# EAGLE design climate_control (EAGLE 6.5.0)
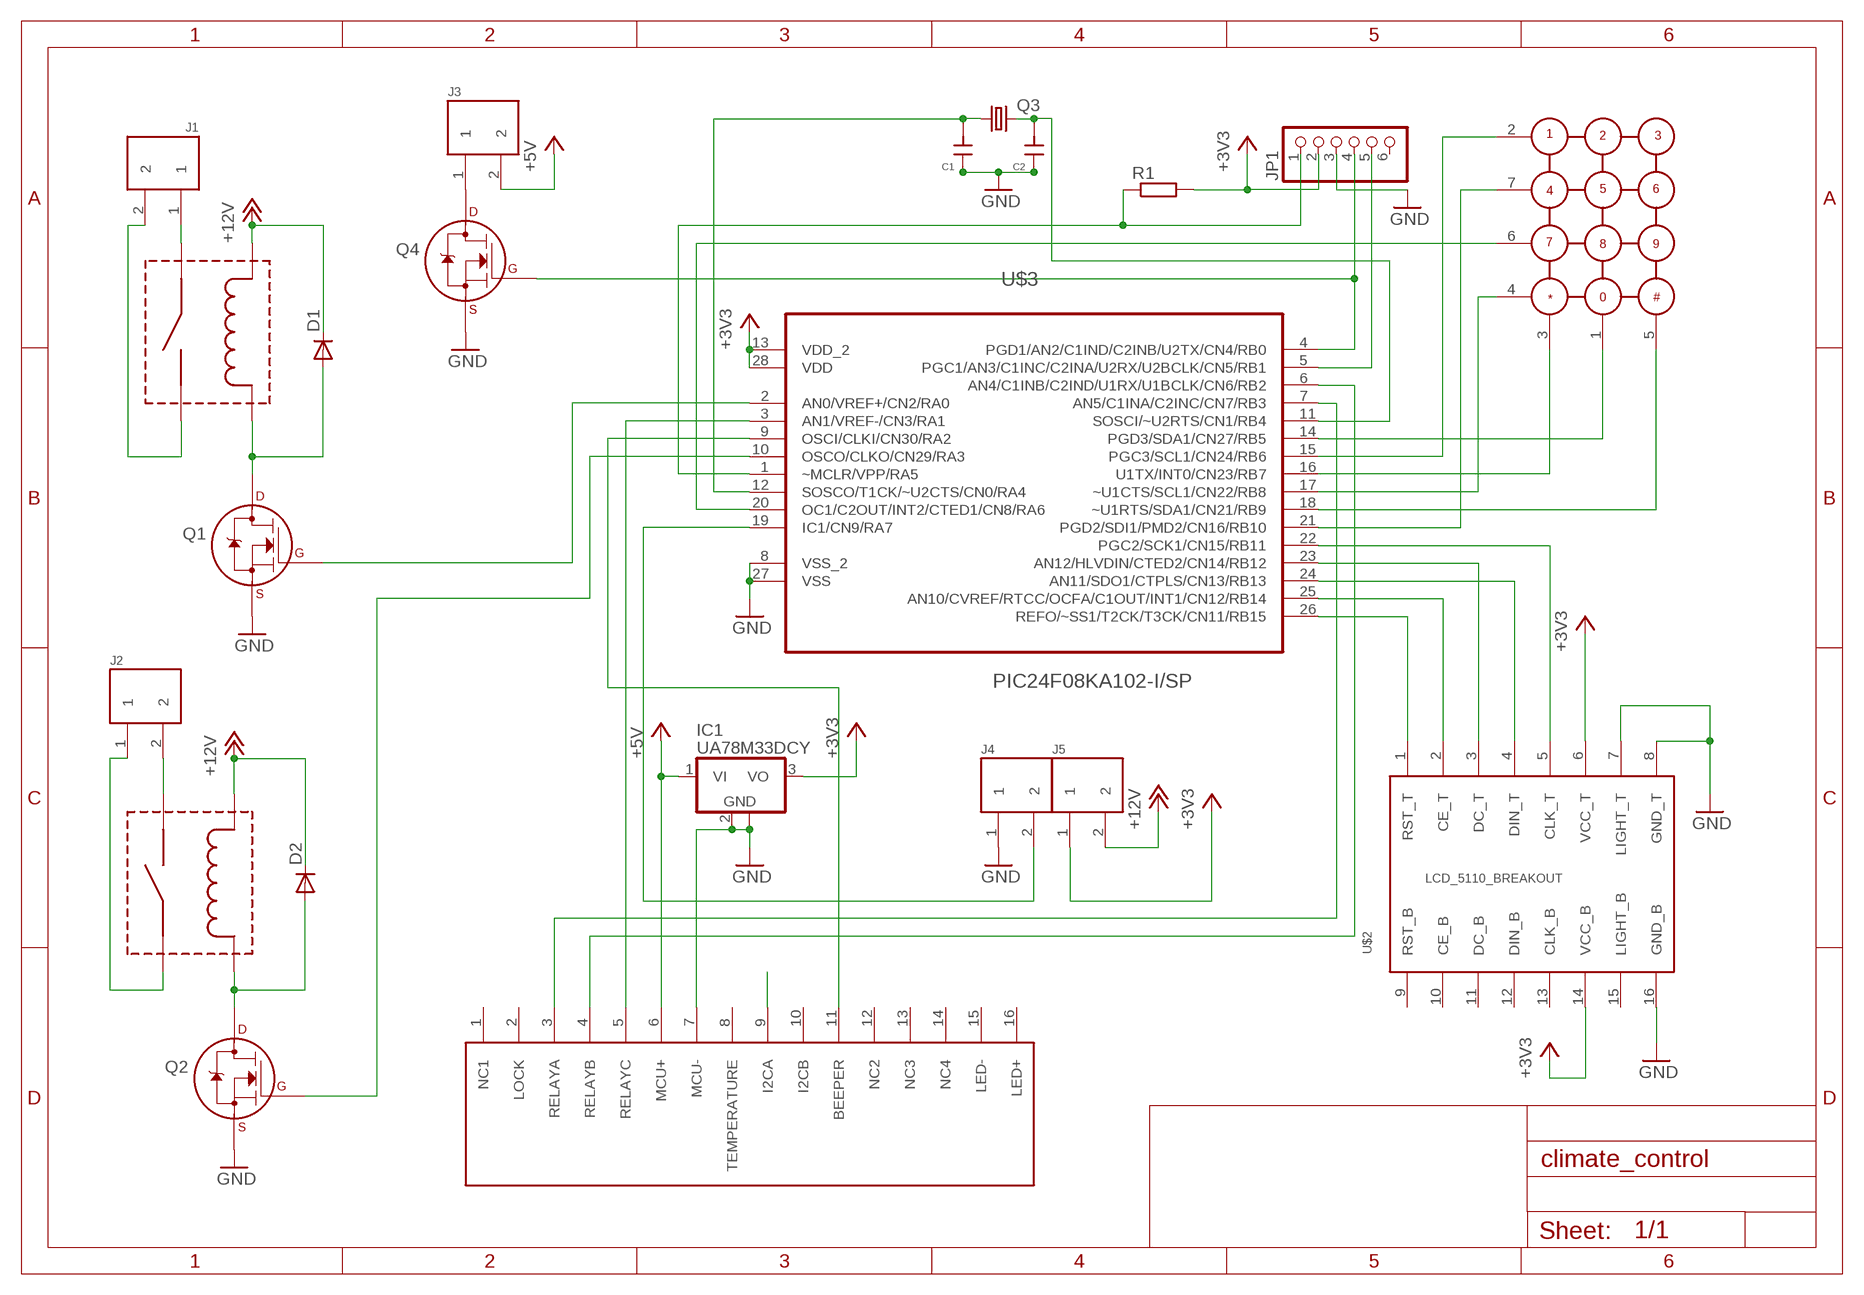
[diagram p0: schematic, sheet 1]

## Parts
C1  DUALCAP  [DUALCAP]
C2  DUALCAP  [DUALCAP]
D1  DIODE-DO-214AC  [DO-214AC]
D2  DIODE-DO-214AC  [DO-214AC]
IC1  UA78M33DCY  [SOT223]
J1  TERMINAL_PCB_508_X2  [TERMINAL_PCB_508_PITCH]
J2  TERMINAL_PCB_508_X2  [TERMINAL_PCB_508_PITCH]
J3  TERMINAL_PCB_508_X2  [TERMINAL_PCB_508_PITCH]
J4  TERMINAL_PCB_508_X2  [TERMINAL_PCB_508_PITCH]
J5  TERMINAL_PCB_508_X2  [TERMINAL_PCB_508_PITCH]
JP1  PINHD-1X6  [1X06]
Q1  2N7000_TO92  [TO-92]
Q2  2N7000_TO92  [TO-92]
Q3  CRYSTALTC38H  [TC38H]
Q4  2N7000_TO92  [TO-92]
R1  R-EU_0207/10  [0207/10]
U$1  KEYPAD12  [KEYPAD12]
U$2  LCD_5110_BREAKOUT  [LCD_5110_BREAKOUT]
U$3  PIC24F08KA102-I/SP  [DIP254P762X533-28]
U$4  WILLHI_EDGE  [WILLHI_EDGE]
U$5  RELAY_JZC-33F  [RELAY_JZC-33F]
U$7  RELAY_JZC-33F  [RELAY_JZC-33F]

## Nets
+3V3: IC1.3(VO) J5.1 JP1.2 R1.2 U$2.6(VCC_T) U$2.14(VCC_B) U$3.13(VDD_2) U$3.28(VDD)
+5V: IC1.1(VI) J3.2 U$4.6(MCU+)
+12V: D1.C D2.C J5.2 U$5.COIL1 U$7.COIL2
GND: C1.P$2 C1.P$3 C2.P$2 C2.P$3 IC1.2(GND) IC1.4(GND) J4.1 JP1.3 Q1.1(S) Q2.1(S) Q4.1(S) U$2.7(LIGHT_T) U$2.8(GND_T) U$2.16(GND_B) U$3.8(VSS_2) U$3.27(VSS) U$4.7(MCU-)
N$1: U$2.4(DIN_T) U$3.24(AN11/SDO1/CTPLS/CN13/RB13)
N$2: U$2.5(CLK_T) U$3.22(PGC2/SCK1/CN15/RB11)
N$3: U$2.3(DC_T) U$3.23(AN12/HLVDIN/CTED2/CN14/RB12)
N$4: U$2.2(CE_T) U$3.25(AN10/CVREF/RTCC/OCFA/C1OUT/INT1/CN12/RB14)
N$5: U$2.1(RST_T) U$3.26(REFO/~SS1/T2CK/T3CK/CN11/RB15)
N$6: U$1.7 U$3.21(PGD2/SDI1/PMD2/CN16/RB10)
N$7: U$1.6 U$3.20(OC1/C2OUT/INT2/CTED1/CN8/RA6)
N$8: U$1.4(*0#) U$3.17(~U1CTS/SCL1/CN22/RB8)
N$9: U$1.5(369#) U$3.18(~U1RTS/SDA1/CN21/RB9)
N$10: U$1.3(147*) U$3.16(U1TX/INT0/CN23/RB7)
N$11: U$1.2 U$3.15(PGC3/SCL1/CN24/RB6)
N$12: U$1.1 U$3.14(PGD3/SDA1/CN27/RB5)
N$13: U$3.9(OSCI/CLKI/CN30/RA2) U$4.11(BEEPER)
N$14: U$4.9(I2CA)
N$15: JP1.1 R1.1 U$3.1(~MCLR/VPP/RA5)
N$16: U$3.3(AN1/VREF-/CN3/RA1) U$4.5(RELAYC)
N$17: JP1.4 Q4.2(G) U$3.4(PGD1/AN2/C1IND/C2INB/U2TX/CN4/RB0)
N$18: JP1.5 U$3.5(PGC1/AN3/C1INC/C2INA/U2RX/U2BCLK/CN5/RB1)
N$19: J4.2 U$3.19(IC1/CN9/RA7)
N$20: U$3.6(AN4/C1INB/C2IND/U1RX/U1BCLK/CN6/RB2) U$4.4(RELAYB)
N$21: U$3.7(AN5/C1INA/C2INC/CN7/RB3) U$4.3(RELAYA)
N$22: D1.A Q1.3(D) U$5.COIL2
N$23: J1.1 U$5.CONTACT1
N$25: J1.2 U$5.CONTACT2
N$26: D2.A Q2.3(D) U$7.COIL1
N$27: J2.2 U$7.CONTACT2
N$28: J2.1 U$7.CONTACT1
N$29: Q1.2(G) U$3.2(AN0/VREF+/CN2/RA0)
N$30: Q2.2(G) U$3.10(OSCO/CLKO/CN29/RA3)
N$31: C1.P$1 Q3.1 U$3.12(SOSCO/T1CK/~U2CTS/CN0/RA4)
N$32: C2.P$1 Q3.2 U$3.11(SOSCI/~U2RTS/CN1/RB4)
N$36: J3.1 Q4.3(D)
Unconnected: JP1.6 U$2.9(RST_B) U$2.10(CE_B) U$2.11(DC_B) U$2.12(DIN_B) U$2.13(CLK_B) U$2.15(LIGHT_B) U$4.1(NC1) U$4.2(LOCK) U$4.8(TEMPERATURE) U$4.10(I2CB) U$4.12(NC2) U$4.13(NC3) U$4.14(NC4) U$4.15(LED-) U$4.16(LED+)

## Library data of the parts
C1 C2 = custom:DUALCAP
D1 D2 = diode:DIODE-: DIODE
IC1 = linear:UA78M*: POSITIVE-VOLTAGE REGULATORS Source: http://focus.ti.com/lit/ds/symlink/ua78m33.pdf
J1-J5 = custom:TERMINAL_PCB_508_X2
JP1 = pinhead:PINHD-1X6: PIN HEADER
Q1 Q2 Q4 = transistors:2N700*: 2N7000, 2N7002, NDS7002A N-channel enhancement mode MOSFET
Q3 = crystal:CRYSTAL: CRYSTAL; OC_FARNELL: unknown; OC_NEWARK: unknown
R1 = rcl:R-EU_: RESISTOR, European symbol
U$1 = KEYPAD12:KEYPAD12
U$2 = LCD5110:LCD_5110_BREAKOUT
U$3 = PIC24F08KA102-I_SP:PIC24F08KA102-I/SP: Flash Microcontrollers; MPN: PIC24F08kA102-I/SP; OC_FARNELL: 1707624; OC_NEWARK: 40M1456; PACKAGE: DIP-28; SUPPLIER: Microchip
U$4 = custom:WILLHI_EDGE
U$5 U$7 = custom:RELAY_JZC-33F

## Board
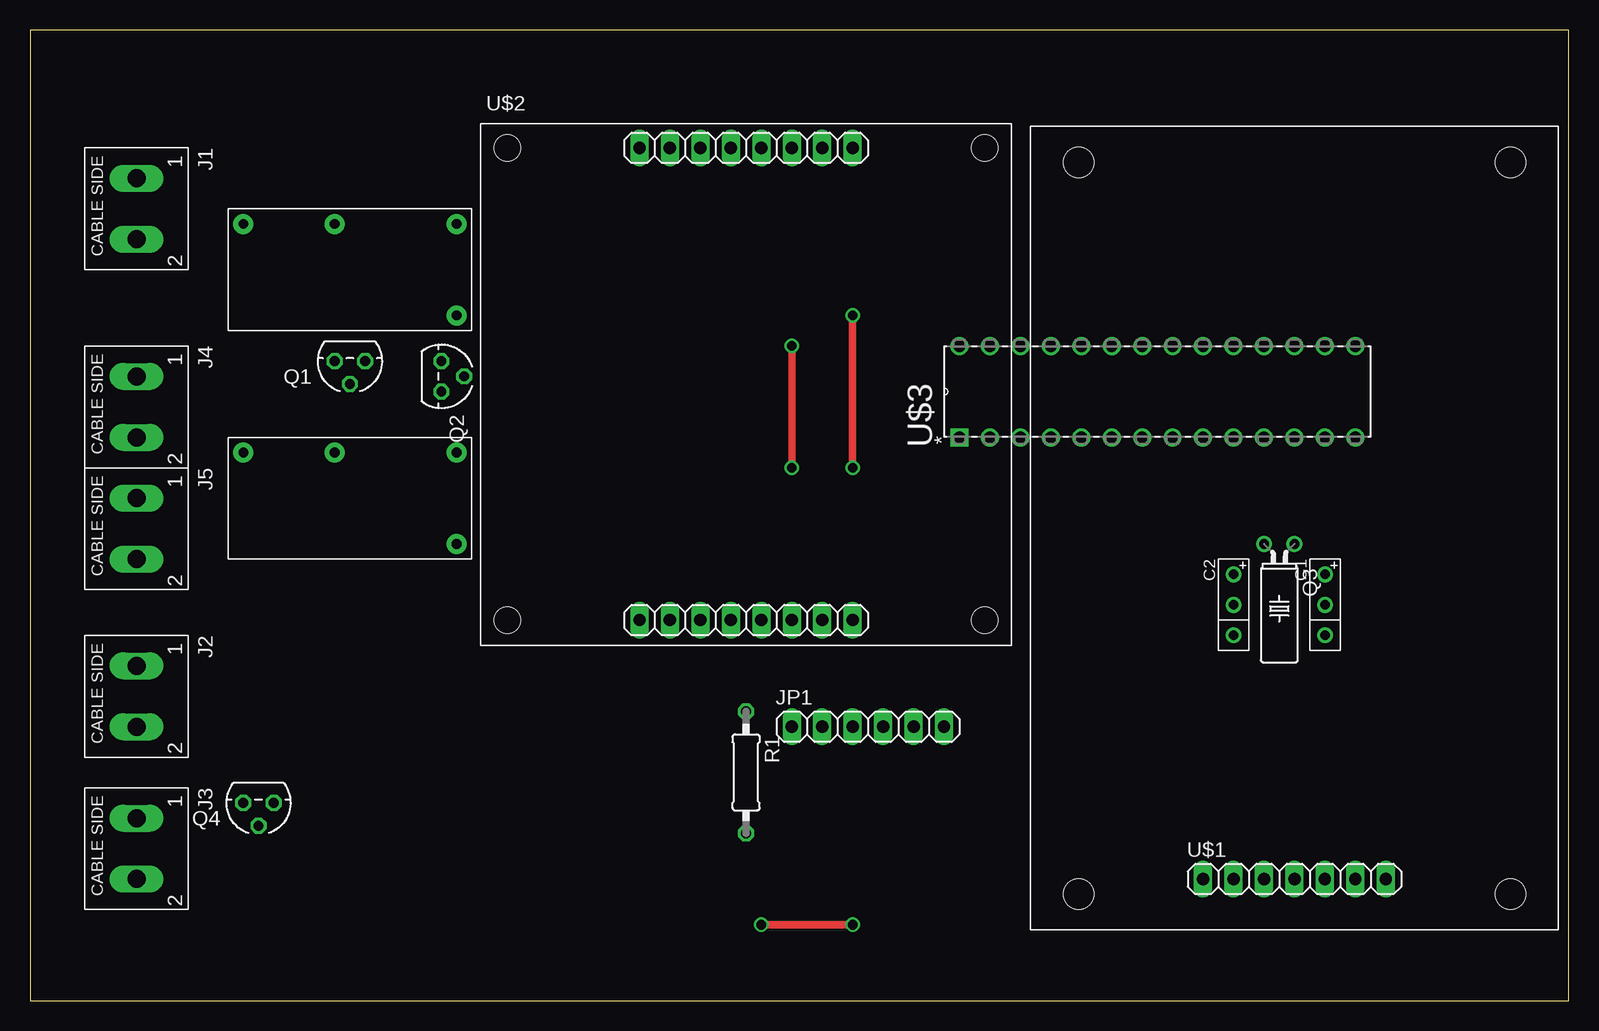
[diagram p1: board, top side]
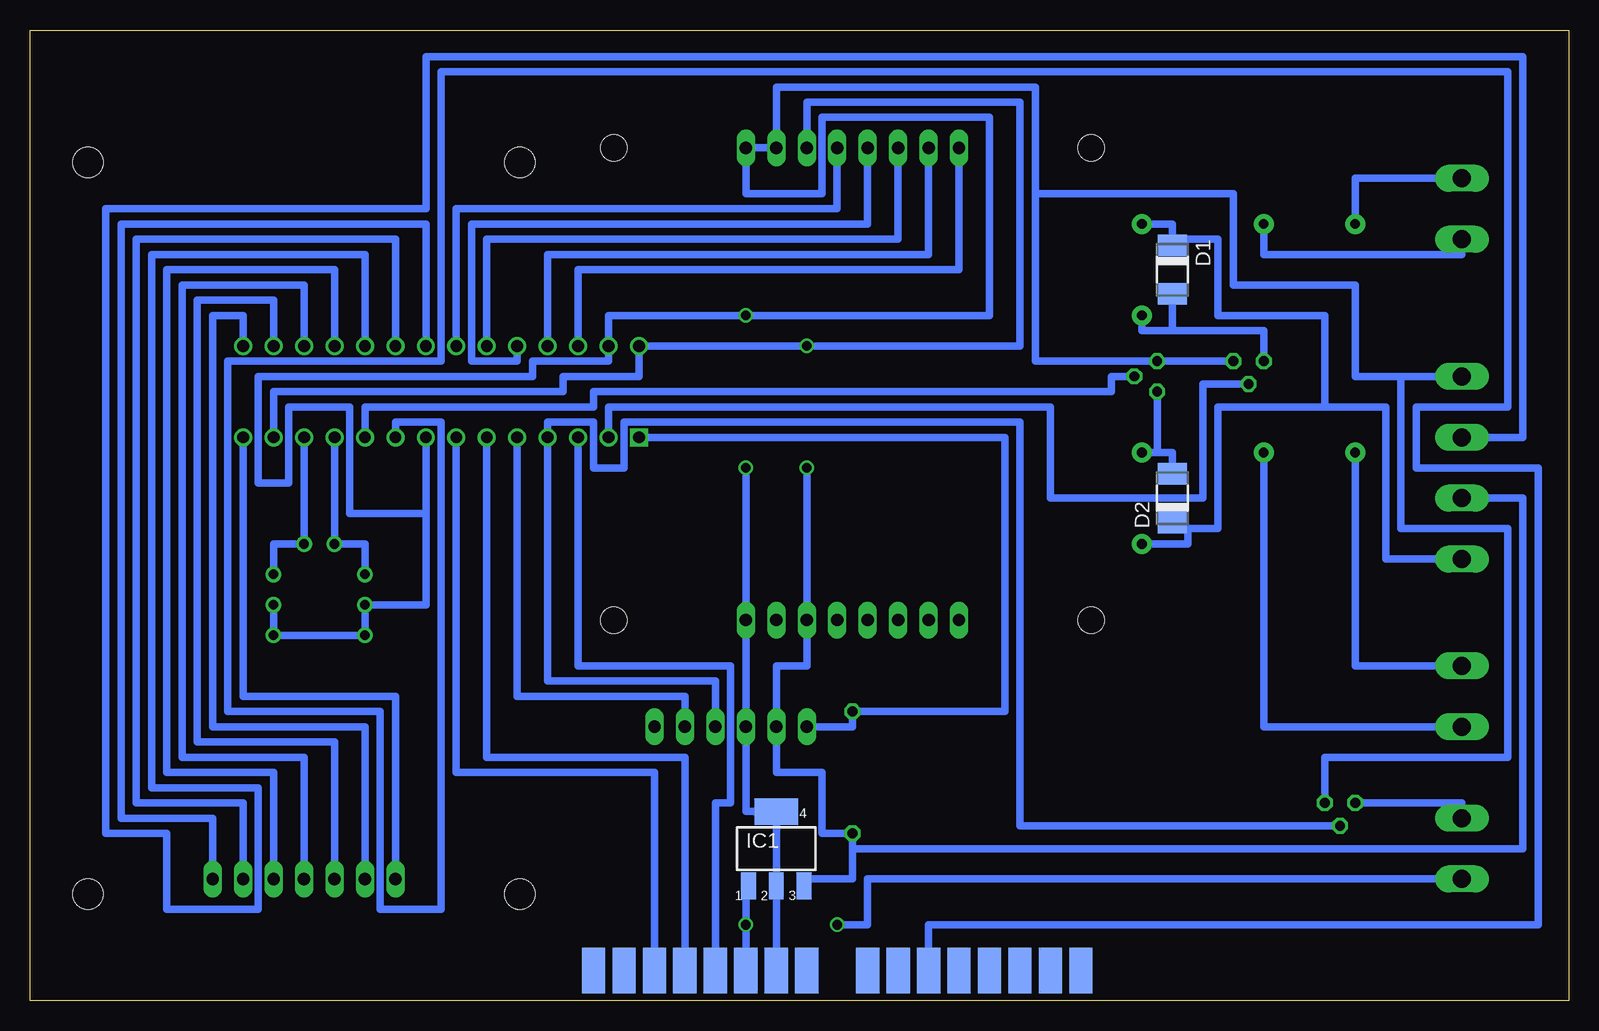
[diagram p2: board, bottom side, seen from below]

Size 128.25 x 80.95 mm. Coordinates in mm from the lower left corner, seen from the top.
Outline: 0,0 128.25,0 128.25,80.95 0,80.95 0,0
Copper layers (1*16): Top 0.035mm / dielectric 1.5mm / Bottom 0.035mm
Design rules "default *": minimum track width 10mil, minimum drill 24mil, track to track 0.2mm, track to pad 0.2mm, pad to pad 0.2mm, via to via 0.2mm, smd to smd 0.2mm, copper to edge 40mil, drill to drill 8mil, minimum pad ring 10mil, minimum via ring 8mil, stop-mask expansion 4mil, vias tented up to drill 0mil, thermal gap 10mil

### Footprints (pad centres in the part's own frame; a part is rotated, then mirrored left to right if it is on the bottom)
DUALCAP = drill 0.8: P$1 0,0; P$2 2.54,0; P$3 5.08,0
DO-214AC = smd 1.8 x 2.4: A 2.025,0; C -2.025,0
SOT223 = smd 1.219 x 2.235: 1 -2.311,-3.099; 2 0,-3.099; 3 2.311,-3.099 | smd 3.6 x 2.2: 4 0,3.099
TERMINAL_PCB_508_PITCH = drill 1.5 long: 1 0,0; 2 5.08,0
1X06 = drill 1.016 long: 1 -6.35,0; 2 -3.81,0; 3 -1.27,0; 4 1.27,0; 5 3.81,0; 6 6.35,0
TO-92 = drill 0.813 octagon: 1 -1.27,0; 2 0,1.905; 3 1.27,0
TC38H = drill 0.813: 1 -1.27,0; 2 1.27,0
0207/10 = drill 0.813 octagon: 1 -5.08,0; 2 5.08,0
KEYPAD12 = drill 1.016 long: 1 -7.62,0; 2 -5.08,0; 3 -2.54,0; 4 0,0; 5 2.54,0; 6 5.08,0; 7 7.62,0 | hole 2.5: -18,-1.25; 18,-1.25; -18,59.75; 18,59.75
LCD_5110_BREAKOUT = drill 1.016 long: 1 0,0; 2 2.54,0; 3 5.08,0; 4 7.62,0; 5 10.16,0; 6 12.7,0; 7 15.24,0; 8 17.78,0; 9 0,-39.37; 10 2.54,-39.37; 11 5.08,-39.37; 12 7.62,-39.37; 13 10.16,-39.37; 14 12.7,-39.37; 15 15.24,-39.37; 16 17.78,-39.37 | hole 2.2: -11,0; 28.8,0; -11,-39.37; 28.8,-39.37
DIP254P762X533-28 = drill 0.991 square: 1 -7.62,33.02 | drill 0.991: 2 -7.62,30.48; 3 -7.62,27.94; 4 -7.62,25.4; 5 -7.62,22.86; 6 -7.62,20.32; 7 -7.62,17.78; 8 -7.62,15.24; 9 -7.62,12.7; 10 -7.62,10.16; 11 -7.62,7.62; 12 -7.62,5.08; 13 -7.62,2.54; 14 -7.62,0; 15 0,0; 16 0,2.54; 17 0,5.08; 18 0,7.62; 19 0,10.16; 20 0,12.7; 21 0,15.24; 22 0,17.78; 23 0,20.32; 24 0,22.86; 25 0,25.4; 26 0,27.94; 27 0,30.48; 28 0,33.02
WILLHI_EDGE = smd 1.93 x 3.81: 1 -20.32,0; 2 -17.78,0; 3 -15.24,0; 4 -12.7,0; 5 -10.16,0; 6 -7.62,0; 7 -5.08,0; 8 -2.54,0; 9 2.54,0; 10 5.08,0; 11 7.62,0; 12 10.16,0; 13 12.7,0; 14 15.24,0; 15 17.78,0; 16 20.32,0
RELAY_JZC-33F = drill 0.8 pad 1.676: COIL1 10.16,0; COIL2 10.16,-7.62; CONTACT1 -7.62,0; CONTACT2 0,0

### Placement (x,y rotation side)
C1  107.95,35.56 270 top
C2  100.33,35.56 270 top
D1  33.02,60.96 270 bottom
D2  33.02,41.91 90 bottom
IC1  66.04,12.7 0 bottom
J1  8.89,68.58 270 top
J2  8.89,27.94 270 top
J3  8.89,15.24 270 top
J4  8.89,52.07 270 top
J5  8.89,41.91 270 top
JP1  69.85,22.86 0 top
Q1  26.67,53.34 180 top
Q2  34.29,52.07 270 top
Q3  104.14,38.1 180 top
Q4  19.05,16.51 180 top
R1  59.69,19.05 270 top
U$1  105.41,10.16 0 top
U$2  50.8,71.12 0 top
U$3  110.49,54.61 90 top
U$4  60.96,2.54 0 bottom
U$5  25.4,64.77 0 top
U$7  25.4,45.72 0 top

### Tracks (layer width: path | path; a pad name or v marks a point on that pad's centre or on a via)
+3V3  (via drill 0.8)
  Top 0.61: v63.5,44.45 v63.5,54.61
  Bottom 0.61: 59.69,12.7 R1.2 62.23,13.97 62.23,19.05 66.04,19.05 JP1.2 66.04,27.94 63.5,27.94 U$2.14 v63.5,44.45 | 59.69,12.7 59.69,10.16 63.73,10.16 IC1.3 | U$2.6 63.5,74.93 45.72,74.93 45.72,54.61 v63.5,54.61 U$3.28 77.47,52.07 83.82,52.07 83.82,50.8 107.95,50.8 U$3.13 | J5.1 3.81,41.91 3.81,12.7 59.69,12.7
+5V  (via drill 0.8)
  Top 0.61: v68.58,6.35 v60.96,6.35
  Bottom 0.61: U$4.6 v68.58,6.35 68.58,9.6 IC1.1 | J3.2 58.42,10.16 58.42,6.35 v60.96,6.35
+12V
  Bottom 0.61: U$7.COIL2 31.75,38.1 31.75,39.37 | D2.C 31.75,39.37 | 31.75,39.37 29.21,39.37 29.21,49.53 20.32,49.53 | 20.32,49.53 20.32,57.15 29.21,57.15 29.21,63.5 32.51,63.5 arc-90 D1.C 33.02,64.77 U$5.COIL1 | J5.2 15.24,36.83 15.24,49.53 20.32,49.53
GND  (via drill 0.8)
  Top 0.61: v68.58,44.45 v68.58,57.15
  Bottom 0.61: U$4.7 IC1.2 IC1.4 68.58,15.8 JP1.3 U$2.16 v68.58,44.45 | Q1.1 Q2.1 44.45,53.34 44.45,67.31 | 44.45,67.31 44.45,76.2 66.04,76.2 U$2.7 U$2.8 68.58,67.31 62.23,67.31 62.23,73.66 48.26,73.66 48.26,57.15 v68.58,57.15 80.01,57.15 U$3.27 80.01,53.34 86.36,53.34 86.36,52.07 109.22,52.07 109.22,43.18 106.68,43.18 106.68,49.53 101.6,49.53 101.6,40.64 95.25,40.64 | 95.25,40.64 95.25,33.02 C2.P$2 C2.P$3 C1.P$3 C1.P$2 | J4.1 13.97,52.07 | 13.97,52.07 17.78,52.07 17.78,59.69 27.94,59.69 27.94,67.31 44.45,67.31 | U$3.8 95.25,40.64 | Q4.1 20.32,20.32 5.08,20.32 5.08,39.37 13.97,39.37 13.97,52.07
N$1
  Bottom 0.61: U$2.4 58.42,64.77 91.44,64.77 91.44,53.34 87.63,53.34 U$3.24
N$2
  Bottom 0.61: U$2.5 60.96,66.04 92.71,66.04 U$3.22
N$3
  Bottom 0.61: U$2.3 55.88,63.5 90.17,63.5 U$3.23
N$4
  Bottom 0.61: U$2.2 53.34,62.23 85.09,62.23 U$3.25
N$5
  Bottom 0.61: U$2.1 50.8,60.96 82.55,60.96 U$3.26
N$6
  Bottom 0.61: U$1.7 113.03,15.24 120.65,15.24 120.65,64.77 95.25,64.77 U$3.21
N$7
  Bottom 0.61: U$1.6 110.49,16.51 119.38,16.51 119.38,63.5 97.79,63.5 U$3.20
N$8
  Bottom 0.61: U$1.4 105.41,20.32 115.57,20.32 115.57,59.69 105.41,59.69 U$3.17
N$9
  Bottom 0.61: U$1.5 107.95,19.05 116.84,19.05 116.84,60.96 102.87,60.96 U$3.18
N$10
  Bottom 0.61: U$1.3 102.87,21.59 114.3,21.59 114.3,58.42 107.95,58.42 U$3.16
N$11
  Bottom 0.61: U$1.2 100.33,22.86 113.03,22.86 113.03,57.15 110.49,57.15 U$3.15
N$12
  Bottom 0.61: U$1.1 97.79,25.4 110.49,25.4 U$3.14
N$13
  Bottom 0.61: U$3.9 97.79,48.26 93.98,48.26 93.98,7.62 99.06,7.62 99.06,24.13 111.76,24.13 111.76,53.34 93.98,53.34 93.98,77.47 5.08,77.47 5.08,49.53 12.7,49.53 12.7,44.45 2.54,44.45 2.54,6.35 53.34,6.35 U$4.11
N$15
  Bottom 0.61: JP1.1 59.69,22.86 R1.1 46.99,24.13 46.99,46.99 U$3.1
N$16
  Bottom 0.61: U$4.5 71.12,16.51 69.85,16.51 69.85,27.94 82.55,27.94 U$3.3
N$17
  Bottom 0.61: JP1.4 71.12,26.67 85.09,26.67 U$3.4 85.09,48.26 81.28,48.26 81.28,44.45 78.74,44.45 78.74,48.26 45.72,48.26 45.72,14.61 Q4.2
N$18
  Bottom 0.61: JP1.5 73.66,25.4 87.63,25.4 U$3.5
N$19
  Bottom 0.61: U$3.19 100.33,62.23 118.11,62.23 118.11,17.78 109.22,17.78 109.22,7.62 116.84,7.62 116.84,13.97 121.92,13.97 121.92,66.04 95.25,66.04 95.25,78.74 3.81,78.74 3.81,46.99 J4.2
N$20
  Bottom 0.61: U$4.4 73.66,20.32 90.17,20.32 U$3.6
N$21
  Bottom 0.61: U$4.3 76.2,19.05 92.71,19.05 U$3.7
N$22
  Bottom 0.61: 33.02,55.88 25.4,55.88 Q1.3 | 33.02,55.88 D1.A | U$5.COIL2 35.56,55.88 33.02,55.88
N$23
  Bottom 0.61: U$5.CONTACT1 17.78,68.58 J1.1
N$25
  Bottom 0.61: U$5.CONTACT2 25.4,62.23 8.89,62.23 J1.2
N$26
  Bottom 0.61: 34.29,45.72 33.02,45.72 D2.A | Q2.3 34.29,45.72 | 34.29,45.72 U$7.COIL1
N$27
  Bottom 0.61: J2.2 25.4,22.86 U$7.CONTACT2
N$28
  Bottom 0.61: J2.1 17.78,27.94 U$7.CONTACT1
N$29
  Bottom 0.61: Q1.2 30.48,51.44 30.48,41.91 43.18,41.91 43.18,49.53 80.01,49.53 U$3.2
N$30
  Bottom 0.61: Q2.2 38.1,52.07 38.1,50.8 81.28,50.8 81.28,49.53 100.33,49.53 U$3.10
N$31
  Bottom 0.61: C1.P$1 107.95,38.1 Q3.1 U$3.12
N$32
  Bottom 0.61: C2.P$1 100.33,38.1 Q3.2 U$3.11
N$36
  Bottom 0.61: J3.1 8.89,16.51 Q4.3